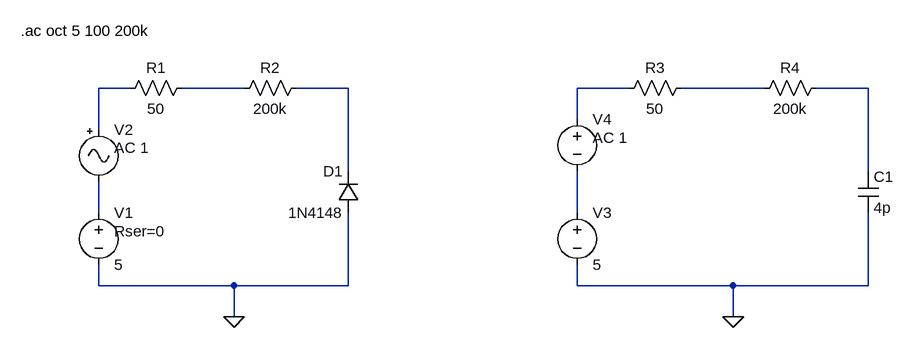
[diagram p0: schematic Draft1.asc]
Draft1.asc, the LTspice schematic file:
Version 4
SHEET 1 1164 680
WIRE -16 -384 -64 -384
WIRE 160 -384 64 -384
WIRE 320 -384 240 -384
WIRE 752 -384 672 -384
WIRE 960 -384 832 -384
WIRE 1120 -384 1040 -384
WIRE 672 -336 672 -384
WIRE -64 -320 -64 -384
WIRE 320 -256 320 -384
WIRE 1120 -256 1120 -384
WIRE -64 -192 -64 -240
WIRE 672 -192 672 -256
WIRE -64 -80 -64 -112
WIRE 144 -80 -64 -80
WIRE 320 -80 320 -192
WIRE 320 -80 144 -80
WIRE 672 -80 672 -112
WIRE 912 -80 672 -80
WIRE 1120 -80 1120 -192
WIRE 1120 -80 912 -80
WIRE 144 -32 144 -80
WIRE 912 -32 912 -80
FLAG 144 -32 0
FLAG 912 -32 0
SYMBOL voltage -64 -208 R0
WINDOW 123 0 0 Left 2
WINDOW 39 24 44 Left 2
SYMATTR SpiceLine Rser=0
SYMATTR InstName V1
SYMATTR Value 5
SYMBOL Misc\\signal -64 -336 R0
WINDOW 123 24 44 Left 2
WINDOW 39 0 0 Left 2
SYMATTR Value2 AC 1
SYMATTR InstName V2
SYMATTR Value ""
SYMBOL res -32 -368 R270
WINDOW 0 32 56 VTop 2
WINDOW 3 0 56 VBottom 2
SYMATTR InstName R1
SYMATTR Value 50
SYMBOL res 256 -400 R90
WINDOW 0 0 56 VBottom 2
WINDOW 3 32 56 VTop 2
SYMATTR InstName R2
SYMATTR Value 200k
SYMBOL diode 336 -192 R180
WINDOW 0 24 64 Left 2
WINDOW 3 24 0 Left 2
SYMATTR InstName D1
SYMATTR Value 1N4148
SYMBOL voltage 672 -208 R0
WINDOW 123 0 0 Left 2
WINDOW 39 0 0 Left 2
SYMATTR InstName V3
SYMATTR Value 5
SYMBOL voltage 672 -352 R0
WINDOW 123 24 44 Left 2
WINDOW 39 0 0 Left 2
SYMATTR InstName V4
SYMATTR Value ""
SYMATTR Value2 AC 1
SYMBOL res 848 -400 R90
WINDOW 0 0 56 VBottom 2
WINDOW 3 32 56 VTop 2
SYMATTR InstName R3
SYMATTR Value 50
SYMBOL res 1056 -400 R90
WINDOW 0 0 56 VBottom 2
WINDOW 3 32 56 VTop 2
SYMATTR InstName R4
SYMATTR Value 200k
SYMBOL cap 1104 -256 R0
SYMATTR InstName C1
SYMATTR Value 4p
TEXT -184 -472 Left 2 !.ac oct 5 100 200k

The netlist it stands for:
* Draft1.asc
V1 N007 0 5 Rser=0
V2 N001 N007 AC 1
R1 N001 N002 50
R2 N003 N002 200k
D1 0 N003 1N4148
V3 N008 0 5
V4 N004 N008 AC 1
R3 N005 N004 50
R4 N006 N005 200k
C1 N006 0 4p
.model D D
.lib standard.dio
.ac oct 5 100 200k
.backanno
.end